# Altium schematic sheet M26_T_V1.0b.SchDoc
size A4
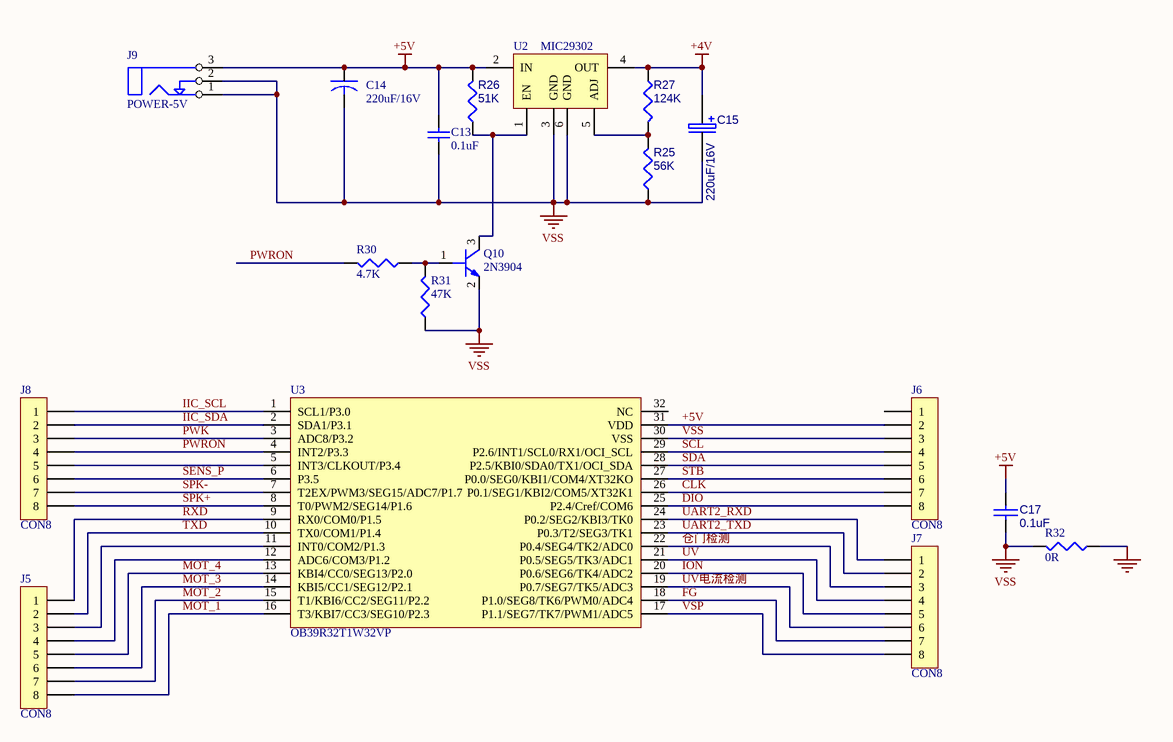
[diagram p0: M26_T_V1.0b.SchDoc]

## Parts
C13  0.1uF  [0805_C]
C14  220uF/16V  [C_TAN_D]
C15  220uF/16V  [C_TAN_D]
C17  0.1uF  [0805_C]
J5  CON8  [SIP-8]
J6  CON8  [SIP-8]
J7  CON8  [SIP-8]
J8  CON8  [SIP-8]
J9  POWER-5V  [DC_5]
Q10  2N3904  [SOT23]
R25  56K  [0603_R]
R26  51K  [0603_R]
R27  124K  [0603_R]
R30  4.7K  [0603_R]
R31  47K  [0603_R]
R32  0R  [0603_R]
U2  MIC29302  [TO-263-5]
U3  OB39R32T1W32VP  [LQFP32]

## Nets
+4V: C15.1(+) R27.2 U2.4(OUT)
+5V: C13.2 C14.1 C17.1 J6.2 J9.3 R26.1 U2.2(IN) U3.31(VDD)
GND: R32.2
VSS: C13.1 C14.2 C15.2(-) C17.2 J6.3 J9.1 J9.2 Q10.2(EMITTER) R25.2 R31.2 R32.1 U2.3(GND) U2.6(GND) U3.30(VSS)
CLK: J6.7 U3.26(P0.1/SEG1/KBI2/COM5/XT32K1)
DIO: J6.8 U3.25(P2.4/Cref/COM6)
FG: J7.7 U3.18(P1.0/SEG8/TK6/PWM0/ADC4)
IIC_SCL: J8.1 U3.1(SCL1/P3.0)
IIC_SDA: J8.2 U3.2(SDA1/P3.1)
ION: J7.5 U3.20(P0.6/SEG6/TK4/ADC2)
MOT_1: J5.8 U3.16(T3/KBI7/CC3/SEG10/P2.3)
MOT_2: J5.7 U3.15(T1/KBI6/CC2/SEG11/P2.2)
MOT_3: J5.6 U3.14(KBI5/CC1/SEG12/P2.1)
MOT_4: J5.5 U3.13(KBI4/CC0/SEG13/P2.0)
PWK: J8.3 U3.3(ADC8/P3.2)
PWRON: J8.4 R30.1 U3.4(INT2/P3.3)
RXD: J5.1 U3.9(RX0/COM0/P1.5)
SCL: J6.4 U3.29(P2.6/INT1/SCL0/RX1/OCI_SCL)
SDA: J6.5 U3.28(P2.5/KBI0/SDA0/TX1/OCI_SDA)
SENS_P: J8.6 U3.6(P3.5)
SPK+: J8.8 U3.8(T0/PWM2/SEG14/P1.6)
SPK-: J8.7 U3.7(T2EX/PWM3/SEG15/ADC7/P1.7)
STB: J6.6 U3.27(P0.0/SEG0/KBI1/COM4/XT32KO)
TXD: J5.2 U3.10(TX0/COM1/P1.4)
UART2_RXD: J7.1 U3.24(P0.2/SEG2/KBI3/TK0)
UART2_TXD: J7.2 U3.23(P0.3/T2/SEG3/TK1)
UV: J7.4 U3.21(P0.5/SEG5/TK3/ADC1)
UV电流检测: J7.6 U3.19(P0.7/SEG7/TK5/ADC3)
VSP: J7.8 U3.17(P1.1/SEG7/TK7/PWM1/ADC5)
仓门检测: J7.3 U3.22(P0.4/SEG4/TK2/ADC0)
NetJ5_3: J5.3 U3.11(INT0/COM2/P1.3)
NetJ5_4: J5.4 U3.12(ADC6/COM3/P1.2)
NetJ8_5: J8.5 U3.5(INT3/CLKOUT/P3.4)
NetQ10_1: Q10.1(BASE) R30.2 R31.1
NetQ10_3: Q10.3(COLLECTOR) R26.2 U2.1(EN)
NetR25_1: R25.1 R27.1 U2.5(ADJ)

Not connected (* = marked no-connect by the designer): J6 1; U3 32(NC)

## Library data of the parts
C13 = Cap Semi: Capacitor; Published: 8-Jun-2000; LatestRevisionDate: 29-May-2009; LatestRevisionNote: IPC-7351 Footprint Added.; PackageReference: C1206; Publisher: Altium Limited; PackageDescription: Chip Capacitor
C14 = C
C15 = ECAP: E-CAP
C17 = CAP
Q10 = NPN
R25-R27 = R0.25W: RESISTOR
R30-R32 = RES1